# EasyEDA Pro project VCF-1u.eprj

# Board Bottom
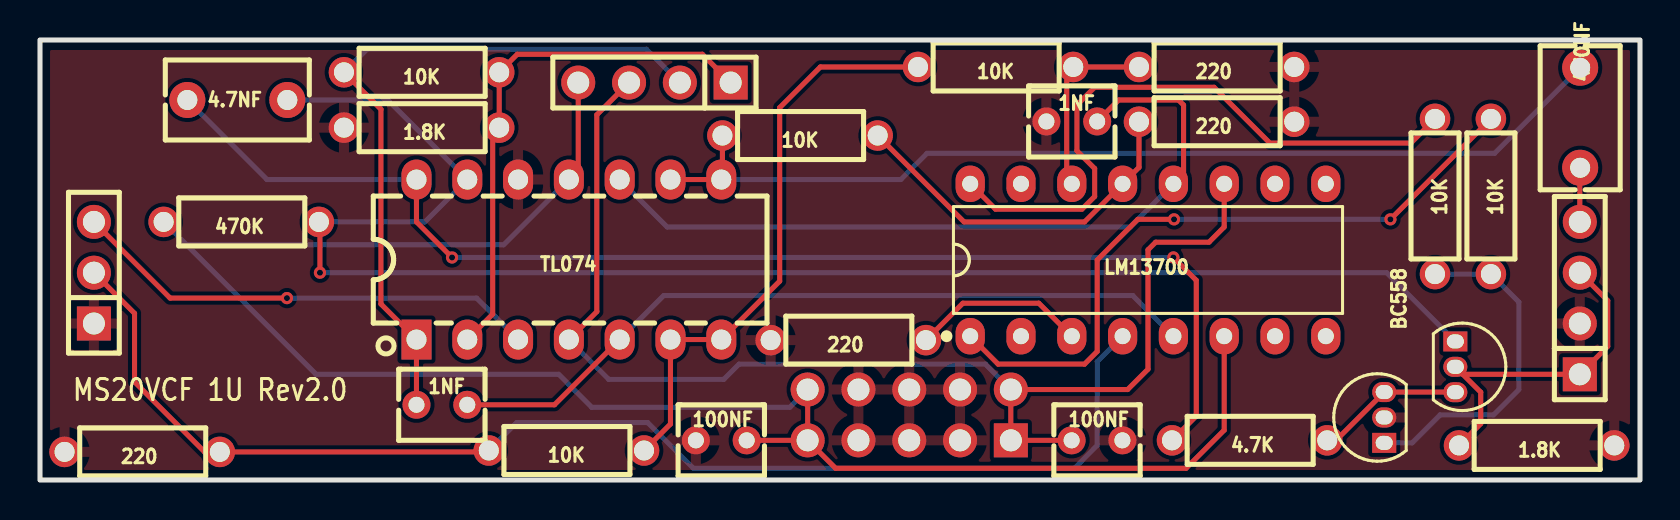
[diagram p0: board, top side]
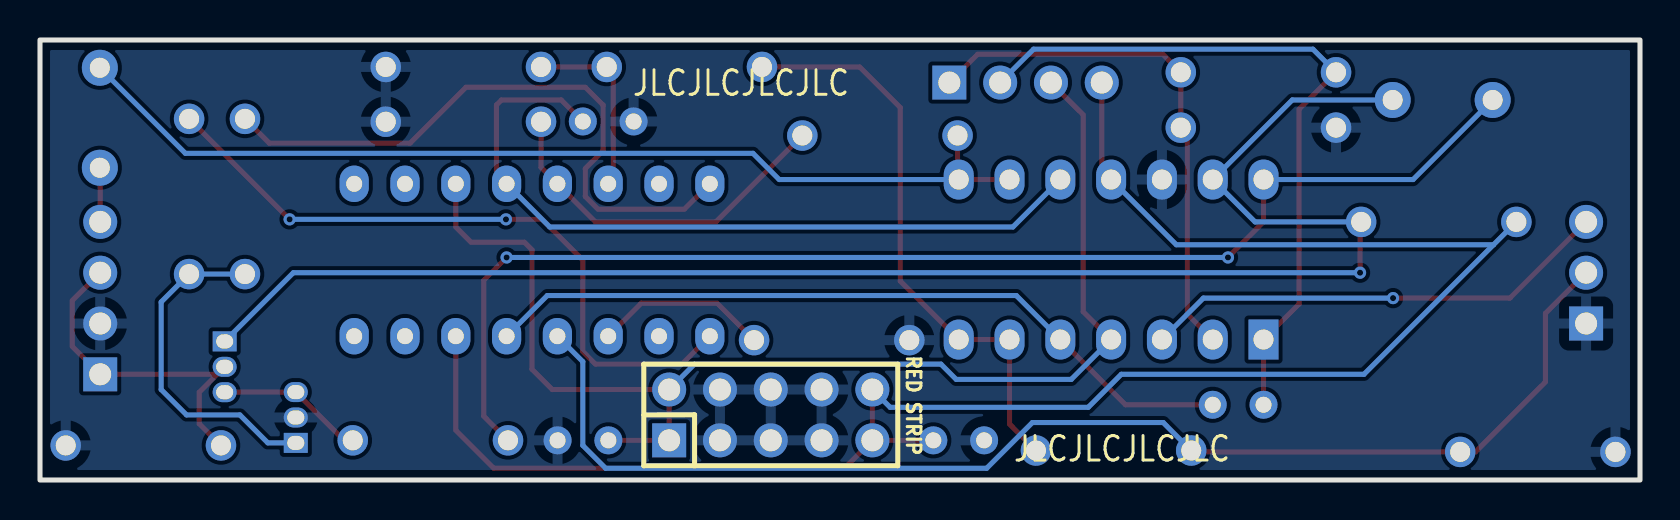
[diagram p1: board, bottom side, seen from below]

Outline 80 x 22 mm; copper layers: Top Layer, Bottom Layer. Coordinates in mm from the lower left corner of the outline.
Outline path: rectangle 0,22 80,0
Stack: Top Layer 0.035mm / Dielectric1 1.51mm FR4 er 4.5 / Bottom Layer 0.035mm

## Design rules (mm)
template: JLCPCB Capability(Two Layers Board)
spacing copperThickness1oz (default): track to track 0.102, other pairs 0.152 to 0.3
spacing copperThickness2oz: track to track 0.203, other pairs 0.152 to 0.3
track width copperThickness1oz (default): min 0.127, default 0.254, max 2.54
track width copperThickness2oz: min 0.203, default 0.254, max 2.54
differential pair differentialPair (default): width min 0.127, default 0.254, max 2.54; gap min 0.152, default 0.152
via viaSize (default): diameter min 0.5, default 0.61, max 10; hole min 0.3, default 0.305, max 6.3

## Placement (name value [footprint] x y rotation side)
1.8K  -  [Resistor_Small]  74.83 1.73 0 top
1.8K#2  -  [Resistor_Small]  19.08 17.62 0 top
1NF  -  [CAP-TH_L4.2-W3.5-P2.54-D0.5]  51.59 17.93 0 top
1NF#2  -  [CAP-TH_L4.2-W3.5-P2.54-D0.5]  20.09 3.76 0 top
4.7K  -  [Resistor_Small]  60.48 1.98 0 top
4.7NF  47nF  [CAP-TH_L7.2-W4.0-P5.00-D0.5]  9.87 19 0 top
10K  -  [Resistor_Small]  72.55 14.18 90 top
10K#2  -  [Resistor_Small]  69.75 14.18 90 top
10K#3  -  [Resistor_Small]  19.08 20.39 0 top
10K#4  -  [Resistor_Small]  26.32 1.48 0 top
10K#5  -  [Resistor_Small]  47.78 20.65 0 top
10K#6  -  [Resistor_Small]  38 17.22 0 top
100NF  -  [CAP-TH_L4.2-W3.5-P2.54-D0.5]  34.06 1.98 0 top
100NF#2  -  [CAP-TH_L4.2-W3.5-P2.54-D0.5]  52.85 1.98 0 top
220  -  [Resistor_Small]  40.41 6.99 0 top
220#2  -  [Resistor_Small]  5.11 1.41 0 top
220#3  -  [Resistor_Small]  58.83 20.65 0 top
220#4  -  [Resistor_Small]  58.83 17.91 0 top
470K  -  [Resistor_Small]  10.06 12.91 0 top
470NF  47nF  [CAP-TH_L7.2-W4.0-P5.00-D0.5]  77.01 18.11 270 top
BC558  -  [TO-92-3_L4.5-W3.5-P1.27-L]  70.77 5.66 270 top
BC558#2  -  [TO-92-3_L4.5-W3.5-P1.27-L]  67.21 3.13 90 top
H1  PZ254V-11-03P  [HDR-TH_3P-P2.54-V-M]  2.7 10.37 90 top
H2  -  [HDR-TH_4P-P2.54-V-M]  30.72 19.87 180 top
H2#2  -  [HDR-TH_4P-P2.54-V-M]  76.99 9.1 90 top
LM13700  LM13700AN  [DIP-16_L19.3-W6.4-P2.54-LS7.6-BL]  55.4 11 0 top
RED STRIP  ZX-PZ2.54-2-5PZZ  [HDR-TH_10P-P2.54-V-M-R2-C5-S2.54]  43.46 3.25 180 bottom
TL074  TL074CN  [PDIP-14_L19.7-W6.6-P2.54-LS8.3-BL]  26.44 11.02 0 top

## Footprints (pads in the part's own frame, mm; a bottom-side part is the same pattern mirrored in y, then rotated)
CAP-TH_L4.2-W3.5-P2.54-D0.5
  round 1.4 hole 0.8: 1(-1.27,0) 2(1.27,0)
CAP-TH_L7.2-W4.0-P5.00-D0.5
  round 1.8 hole 1: 1(-2.499,0) 2(2.499,0)
DIP-16_L19.3-W6.4-P2.54-LS7.6-BL
  oval 1.46x1.825 hole 0.8: 1(-8.89,-3.81) 2(-6.35,-3.81) 3(-3.81,-3.81) 4(-1.27,-3.81) 5(1.27,-3.81) 6(3.81,-3.81) 7(6.35,-3.81) 8(8.89,-3.81) 9(8.89,3.81) 10(6.35,3.81) 11(3.81,3.81) 12(1.27,3.81) 13(-1.27,3.81) 14(-3.81,3.81) 15(-6.35,3.81) 16(-8.89,3.81)
HDR-TH_3P-P2.54-V-M
  rect 1.7x1.7 hole 1.1: 1(-2.54,0)
  round 1.7 hole 1.1: 2(0,0) 3(2.54,0)
HDR-TH_4P-P2.54-V-M
  rect 1.7x1.7 hole 1.1: 1(-3.81,0)
  round 1.7 hole 1.1: 2(-1.27,0) 3(1.27,0) 4(3.81,0)
HDR-TH_10P-P2.54-V-M-R2-C5-S2.54
  rect 1.7x1.7 hole 1.1: 1(-5.08,-1.27)
  round 1.7 hole 1.1: 2(-5.08,1.27) 3(-2.54,-1.27) 4(-2.54,1.27) 5(0,-1.27) 6(0,1.27) 7(2.54,-1.27) 8(2.54,1.27) 9(5.08,-1.27) 10(5.08,1.27)
PDIP-14_L19.7-W6.6-P2.54-LS8.3-BL
  rect 1.5x2 hole 1: 1(-7.62,-4)
  oval 1.5x2 hole 1: 2(-5.08,-4) 3(-2.54,-4) 4(0,-4) 5(2.54,-4) 6(5.08,-4) 7(7.62,-4) 8(7.62,4) 9(5.08,4) 10(2.54,4) 11(0,4) 12(-2.54,4) 13(-5.08,4) 14(-7.62,4)
Resistor_Small
  round 1.524 hole 1: 1(-3.88,0) 2(3.882,0)
TO-92-3_L4.5-W3.5-P1.27-L
  rect 1x1.2 hole 0.7x0.85: 1(-1.27,0)
  oval 1x1.2 hole 0.7x0.85: 2(0,0) 3(1.27,0)

## Nets
GND: 1.8K.2 1.8K#2.1 1NF.1 100NF.1 100NF#2.2 220.1 220#2.1 220#3.2 220#4.2 BC558#2.2 H1.1 H2#2.2 RED STRIP.3 RED STRIP.4 RED STRIP.5 RED STRIP.6 RED STRIP.7 RED STRIP.8 TL074.12
+12: 100NF#2.1 H2.3 LM13700.11 RED STRIP.1 RED STRIP.2 TL074.4
-12: 100NF.2 470K.1 H2.4 LM13700.6 RED STRIP.9 RED STRIP.10 TL074.11
CV_MID: 1.8K.1 BC558.2 H2#2.1 H2#2.3
L1: 1NF#2.1 10K#3.1 H2.2 TL074.1
L2: 1.8K#2.2 10K#3.2 H2.1 TL074.2
LP: 10K#4.1 220#2.2 H1.2 LM13700.4
OUT: 470NF.2 H2#2.4
RES_MID: H1.3 TL074.3

Pads without a net: 1NF 2; 1NF#2 2; 4.7K 1 2; 4.7NF 1 2; 10K 1 2; 10K#2 1 2; 10K#4 2; 10K#5 1 2; 10K#6 1 2; 220 2; 220#3 1; 220#4 1; 470K 2; 470NF 1; BC558 1 3; BC558#2 1 3; LM13700 1 2 3 5 7 8 9 10 12 13 14 15 16; TL074 5 6 7 8 9 10 13 14

## Via types
v1: diameter 0.61, hole 0.305, Top Layer to Bottom Layer, 6 vias

## Routing (per net, layer and track width the routed paths; a pad name or vN(x,y) marks a point on that pad's centre or on a via; arc(x,y) is an arc through that point)
(no net): length 426.9
  Top Layer w0.254: 1NF.2 53.93,19 56.92,19 57.18,18.75 57.18,15.32 LM13700.12 ; LM13700.1 47.91,5.79 52.23,5.79 52.86,6.43 52.86,11 54.89,13.03 v1(56.7,13.03) ; 10K#5.1 39.02,20.65 36.98,18.62 36.98,9.94 TL074.7 TL074.6 31.52,2.8 10K#4.2 ; 4.7K.2 64.8,1.98 BC558#2.3 70.76,4.4 BC558.3 ; 220#4.1 54.95,15.63 LM13700.13 52.23,12.91 46.2,12.91 10K#6.2 ; 470K.2 14,12.85 v1(14,10.37) ; LM13700.16 47.78,13.54 52.1,13.54 52.73,14.18 52.73,15.57 51.84,16.46 51.84,18.75 52.73,19.64 58.7,19.64 61.5,16.84 68.54,16.84 10K#2.2 ; TL074.9 TL074.8 34.12,15.08 10K#6.1 ; 10K.2 v1(67.52,13.03) ; v1(20.6,11.13) 18.82,12.91 TL074.14 ; LM13700.3 49.94,8.84 46.14,8.84 220.2 ; 220#3.1 10K#5.2 51.34,20.33 51.34,15.06 LM13700.14 ; TL074.5 25.72,3.76 1NF#2.2 ; 4.7K.1 57.81,3.2 57.81,9.98 v1(56.67,11.13)
  Bottom Layer w0.254: TL074.10 31.36,12.65 54.51,12.65 LM13700.12 ; 4.7NF.2 17.39,19 TL074.13 19.25,12.91 470K.2 ; v1(14,10.37) 67.33,10.37 BC558.1 ; 10K#2.1 10K.1 73.94,8.9 73.94,4.52 72.67,3.25 70.01,3.25 68.61,1.86 BC558#2.1 ; 470NF.1 72.73,16.33 44.35,16.33 43.04,15.02 TL074.8 ; TL074.14 11.35,15.02 4.7NF.1 ; v1(20.6,11.13) v1(56.67,11.13) ; v1(56.7,13.03) v1(67.52,13.03) ; TL074.5 31.18,9.22 54.64,9.22 LM13700.5
+12: length 63.1
  Top Layer w0.254: H2.3 27.84,18.26 27.84,8.42 TL074.4 ; LM13700.11 59.21,12.65 58.45,11.89 55.78,11.89 55.4,11.51 55.4,5.54 54.38,4.52 RED STRIP.2 RED STRIP.1 100NF#2.1
  Bottom Layer w0.254: TL074.4 28.44,5.03 34.19,5.03 34.95,5.79 47.27,5.79 RED STRIP.2
-12: length 94.4
  Top Layer w0.254: 100NF.2 RED STRIP.9 ; RED STRIP.9 RED STRIP.10 ; RED STRIP.9 39.78,0.59 57.3,0.59 59.21,2.49 LM13700.6 ; H2.4 26.91,15.49 TL074.11
  Bottom Layer w0.254: TL074.11 23.18,11.76 7.32,11.76 ; 7.32,11.76 470K.1 ; 7.32,11.76 13.8,5.29 25.94,5.29 27.59,3.63 37.49,3.63 RED STRIP.10
CV_MID: length 17
  Top Layer w0.254: 71.14,5.29 72.04,4.39 72.04,2.81 1.8K.1 ; 71.14,5.29 BC558.2 ; 71.14,5.29 H2#2.1 78.39,6.68 78.39,8.97 H2#2.3
L1: length 36.1
  Top Layer w0.254: 1NF#2.1 TL074.1 17.05,8.8 17.05,18.54 10K#3.1
  Bottom Layer w0.254: H2.2 30.32,21.54 16.35,21.54 10K#3.1
L2: length 26.6
  Top Layer w0.254: H2.1 33.12,21.29 23.86,21.29 10K#3.2 1.8K#2.2 22.63,17.29 22.63,8.29 TL074.2
LP: length 63.9
  Top Layer w0.254: 10K#4.1 22.37,1.41 220#2.2 8.23,1.41 4.73,4.9 4.73,8.33 H1.2
  Bottom Layer w0.254: LM13700.4 52.86,5.92 52.86,1.73 51.72,0.59 32.67,0.59 30.38,2.87 23.84,2.87 10K#4.1
OUT: length 2.7
  Top Layer w0.254: 470NF.2 76.99,15.59 H2#2.4
RES_MID: length 23.6
  Top Layer w0.254: H1.3 6.51,9.1 v1(12.35,9.1)
  Bottom Layer w0.254: v1(12.35,9.1) 21.83,9.1 TL074.3

## Copper pours and planes (outline as drawn; the poured copper is in the pictures)
GND on Top Layer: 0,22 80,22 80,0 0,0
GND on Bottom Layer: 0,22 80,22 80,0 0,0

## Text on the board
Bottom Silkscreen Layer: JLCJLCJLCJLC
Top Silkscreen Layer: MS20VCF 1U Rev2.0

# Board Top
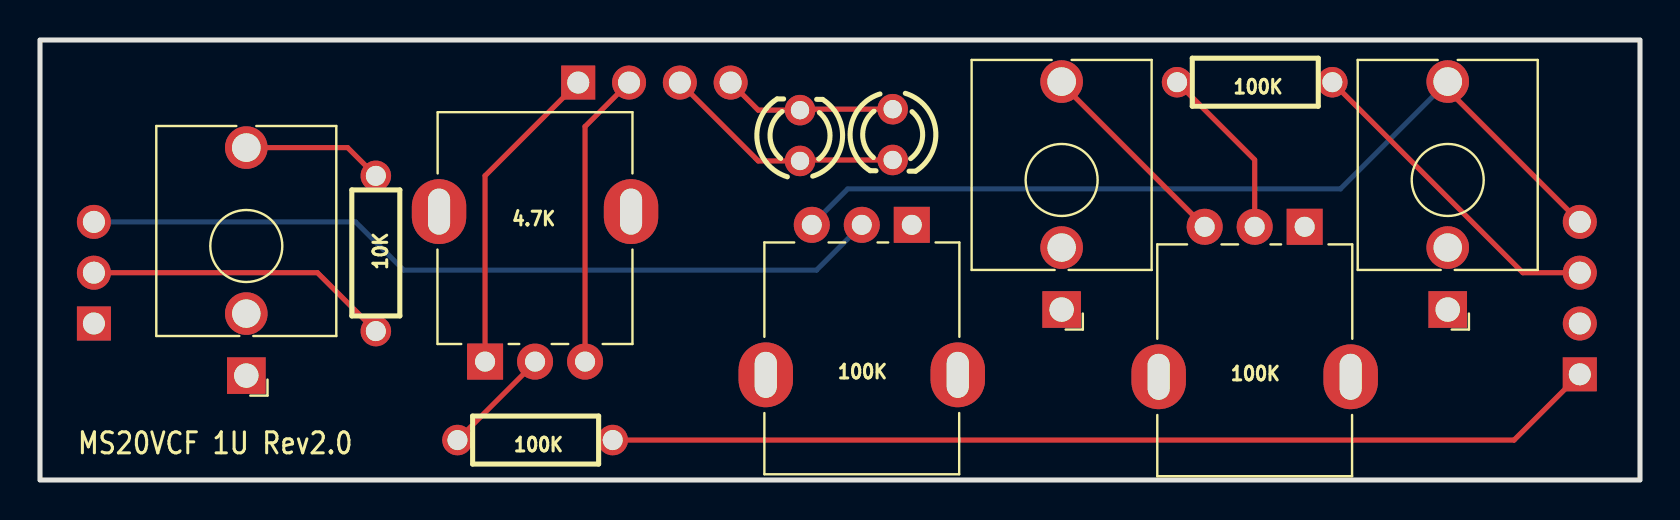
[diagram p2: board, top side]
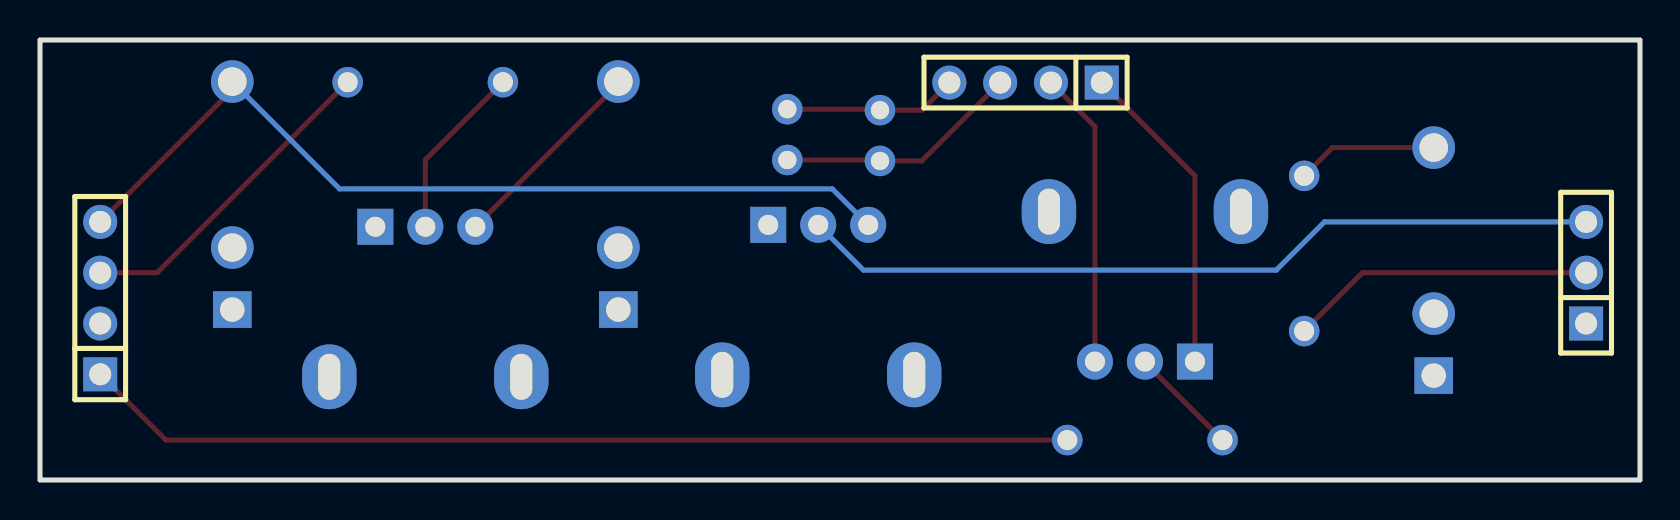
[diagram p3: board, bottom side, seen from below]

Outline 80 x 22 mm; copper layers: Top Layer, Bottom Layer. Coordinates in mm from the lower left corner of the outline.
Outline path: rectangle 0,22 80,0
Stack: Top Layer 0.035mm / Dielectric1 1.51mm FR4 er 4.5 / Bottom Layer 0.035mm

## Design rules (mm)
template: JLCPCB Capability(Two Layers Board)
spacing copperThickness1oz (default): track to track 0.102, other pairs 0.152 to 0.3
spacing copperThickness2oz: track to track 0.203, other pairs 0.152 to 0.3
track width copperThickness1oz (default): min 0.127, default 0.254, max 2.54
track width copperThickness2oz: min 0.203, default 0.254, max 2.54
differential pair differentialPair (default): width min 0.127, default 0.254, max 2.54; gap min 0.152, default 0.152
via viaSize (default): diameter min 0.5, default 0.61, max 10; hole min 0.3, default 0.305, max 6.3

## Placement (name value [footprint] x y rotation side)
4.7K  -  [benjiaomodular:Potentiometer_RV09]  22.25 5.92 90 top
10K  -  [Resistor_Small]  16.79 11.33 90 top
100K  -  [benjiaomodular:Potentiometer_RV09]  43.59 12.76 270 top
100K#2  -  [benjiaomodular:Potentiometer_RV09]  63.23 12.66 270 top
100K#3  -  [Resistor_Small]  24.75 2 0 top
100K#4  -  [Resistor_Small]  60.73 19.89 0 top
H1  PZ254V-11-03P  [HDR-TH_3P-P2.54-V-M]  2.7 10.37 90 bottom
H2  -  [HDR-TH_4P-P2.54-V-M]  30.72 19.87 0 bottom
H2#2  -  [HDR-TH_4P-P2.54-V-M]  76.99 9.1 90 bottom
J1  -  [benjiaomodular:AudioJack_3.5mm]  10.32 5.22 180 top
J1#2  -  [benjiaomodular:AudioJack_3.5mm]  70.39 8.52 180 top
J1#3  -  [benjiaomodular:AudioJack_3.5mm]  51.08 8.52 180 top
LED1  204-10SURD/S530-A3-L  [LED-TH_BD3.0-P2.54-FD]  38 17.22 90 top
LED2  204-10SURD/S530-A3-L  [LED-TH_BD3.0-P2.54-FD]  42.63 17.27 270 top

## Footprints (pads in the part's own frame, mm; a bottom-side part is the same pattern mirrored in y, then rotated)
benjiaomodular:AudioJack_3.5mm
  rect 1.93x1.83 hole 1.22: S(0,0)
  round 2.13 hole 1.43: T(0,-11.4)
  round 2.13 hole 1.42: TN(0,-3.1)
benjiaomodular:Potentiometer_RV09
  rect 1.8x1.8 hole 1: 1(0,0)
  round 1.8 hole 1: 2(0,-2.5) 3(0,-5)
  oval 3.24x2.72 hole 2.3x1.1: 4(7.5,-7.3) 5(7.5,2.3)
HDR-TH_3P-P2.54-V-M
  rect 1.7x1.7 hole 1.1: 1(-2.54,0)
  round 1.7 hole 1.1: 2(0,0) 3(2.54,0)
HDR-TH_4P-P2.54-V-M
  rect 1.7x1.7 hole 1.1: 1(-3.81,0)
  round 1.7 hole 1.1: 2(-1.27,0) 3(1.27,0) 4(3.81,0)
LED-TH_BD3.0-P2.54-FD
  round 1.524 hole 0.914: 1(-1.27,0) 2(1.27,0)
Resistor_Small
  round 1.524 hole 1: 1(-3.88,0) 2(3.882,0)

## Nets
GND: 100K.1 100K#2.1 H1.1 H2#2.2 J1.S J1#2.S J1#3.S
+12: 4.7K.3 H2.2
-12: 4.7K.1 H2.1
CUTOFF: 100K#3.2 H2#2.1
CV_MID: 100K#4.2 H2#2.3
L1: H2.3 LED1.1 LED2.2
L2: H2.4 LED1.2 LED2.1
LP: 10K.1 H1.2
OUT: 100K.3 H2#2.4 J1#2.T
RES_MID: 100K.2 H1.3

Pads without a net: 4.7K 2 4 5; 10K 2; 100K 4 5; 100K#2 2 3 4 5; 100K#3 1; 100K#4 1; J1 T TN; J1#2 TN; J1#3 T TN

## Routing (per net, layer and track width the routed paths; a pad name or vN(x,y) marks a point on that pad's centre or on a via; arc(x,y) is an arc through that point)
(no net): length 31.7
  Top Layer w0.254: 10K.2 15.38,16.62 J1.T ; 4.7K.2 24.75,5.88 100K#3.1 ; 100K#2.3 51.08,19.81 J1#3.T ; 100K#2.2 60.73,16.01 100K#4.1
+12: length 14.9
  Top Layer w0.254: H2.2 27.25,17.67 4.7K.3
-12: length 15.9
  Top Layer w0.254: H2.1 22.25,15.21 4.7K.1
CUTOFF: length 49.7
  Top Layer w0.254: 100K#3.2 73.7,2 H2#2.1
CV_MID: length 16.3
  Top Layer w0.254: H2#2.3 74.14,10.37 100K#4.2
L1: length 12.3
  Top Layer w0.254: LED2.2 38.05,16 LED1.1 35.91,15.95 H2.3
L2: length 8.7
  Top Layer w0.254: LED2.1 38.05,18.54 LED1.2 35.91,18.49 H2.4
LP: length 15.3
  Top Layer w0.254: 10K.1 13.87,10.37 H1.2
OUT: length 44.5
  Top Layer w0.254: J1#2.T 70.39,19.51 H2#2.4
  Bottom Layer w0.254: 100K.3 40.39,14.56 65.02,14.56 J1#2.T
RES_MID: length 40.3
  Bottom Layer w0.254: H1.3 15.78,12.91 18.19,10.49 38.82,10.49 100K.2

## Copper pours and planes (outline as drawn; the poured copper is in the pictures)
GND on Top Layer: 0,22 80,22 80,0 0,0
GND on Bottom Layer: 0,22 80,22 80,0 0,0

## Text on the board
Top Silkscreen Layer: MS20VCF 1U Rev2.0

# Board Panel
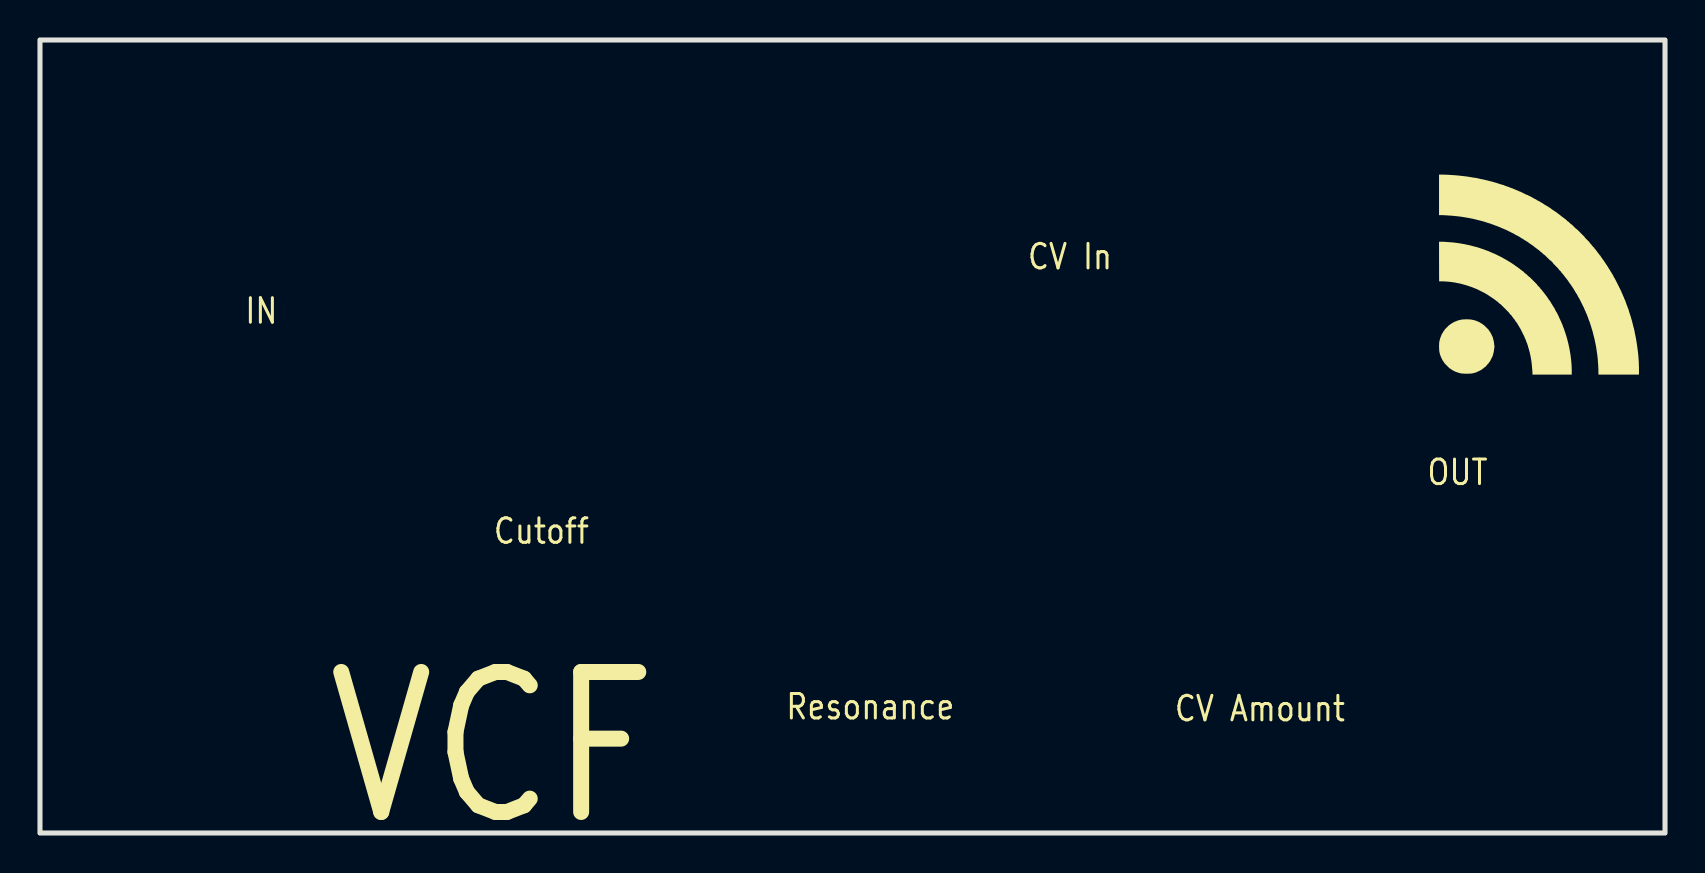
[diagram p4: board, top side]
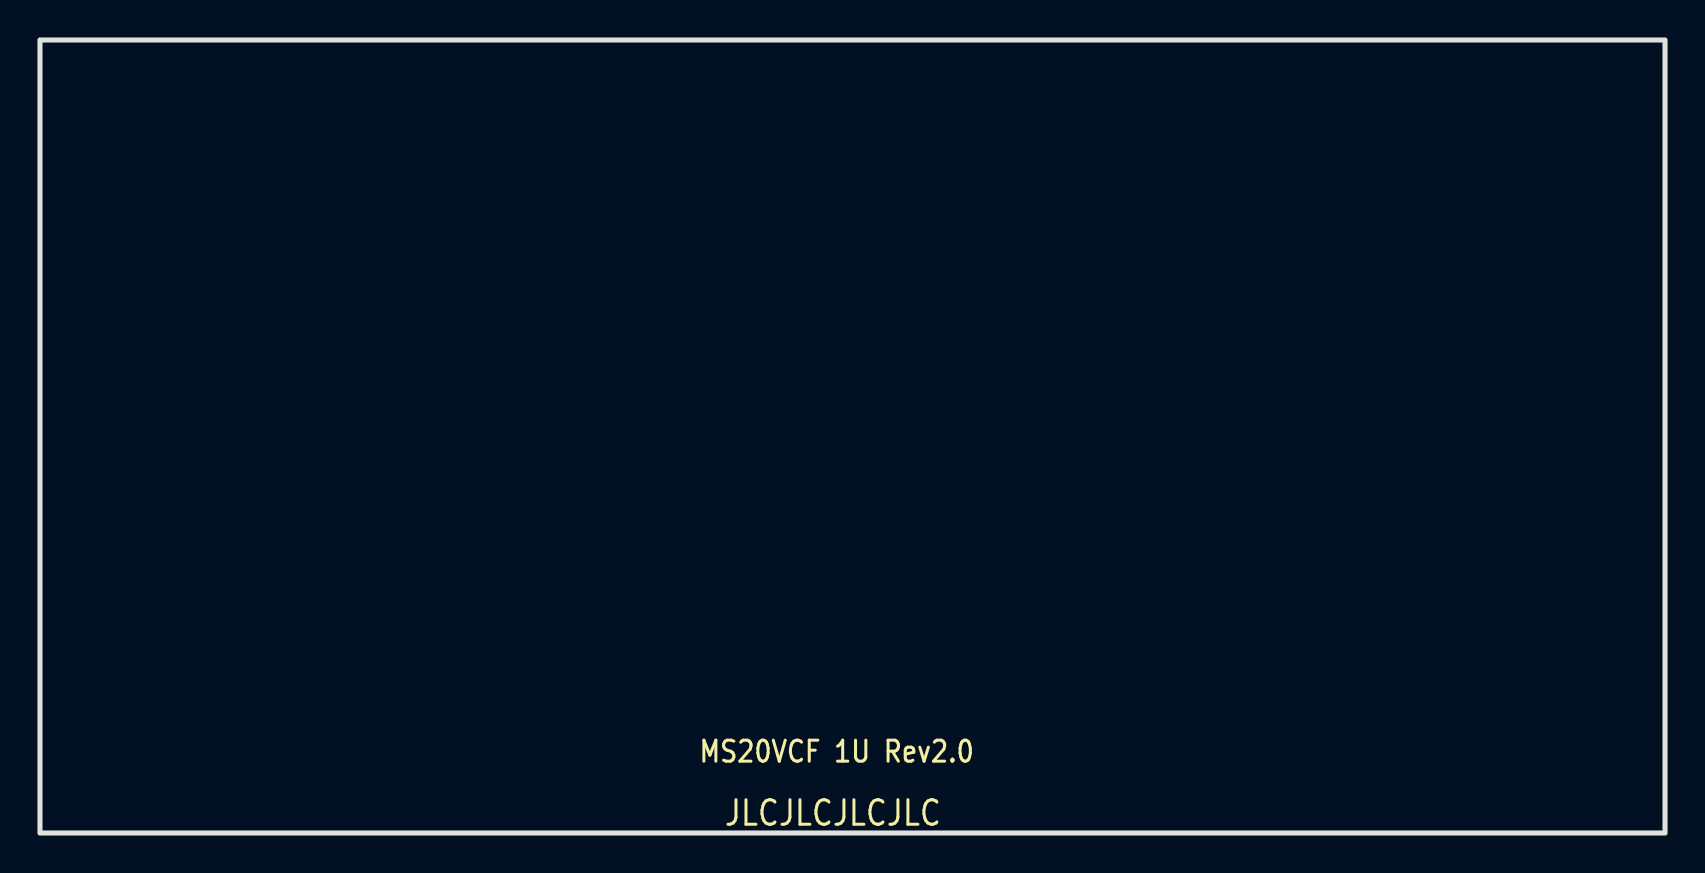
[diagram p5: board, bottom side, seen from below]

Outline 81.28 x 39.65 mm; copper layers: Top Layer, Bottom Layer. Coordinates in mm from the lower left corner of the outline.
Outline path: rectangle 0,39.65 81.28,0
Stack: Top Layer 0.035mm / Dielectric1 1.51mm FR4 er 4.5 / Bottom Layer 0.035mm

## Design rules (mm)
template: JLCPCB Capability(Two Layers Board)
spacing copperThickness1oz (default): track to track 0.102, other pairs 0.152 to 0.3
spacing copperThickness2oz: track to track 0.203, other pairs 0.152 to 0.3
track width copperThickness1oz (default): min 0.127, default 0.254, max 2.54
track width copperThickness2oz: min 0.203, default 0.254, max 2.54
differential pair differentialPair (default): width min 0.127, default 0.254, max 2.54; gap min 0.152, default 0.152
via viaSize (default): diameter min 0.5, default 0.61, max 10; hole min 0.3, default 0.305, max 6.3

## Placement (name value [footprint] x y rotation side)

## Nets

## Text on the board
Bottom Silkscreen Layer: MS20VCF 1U Rev2.0 | JLCJLCJLCJLC
Top Silkscreen Layer: IN | Cutoff | Resonance | CV In | CV Amount | OUT | VCF
